# Altium project MIXR Power.PrjPcb (part 3 of 3)

## Sheet MIXR Power - Battery Management.SchDoc: MIXR Power - Battery Management
size B; Organization: Midnight Sun Solar Rayce Car Team; Address1: University of Waterloo; Address2: 200 University Ave W; Address3: Waterloo, ON, Canada; Address4: N2L 3E9; DocumentNumber: 4; SheetNumber: 4; SheetTotal: 8; Website: www.uwmidsun.com; ProjectName: ProjectName
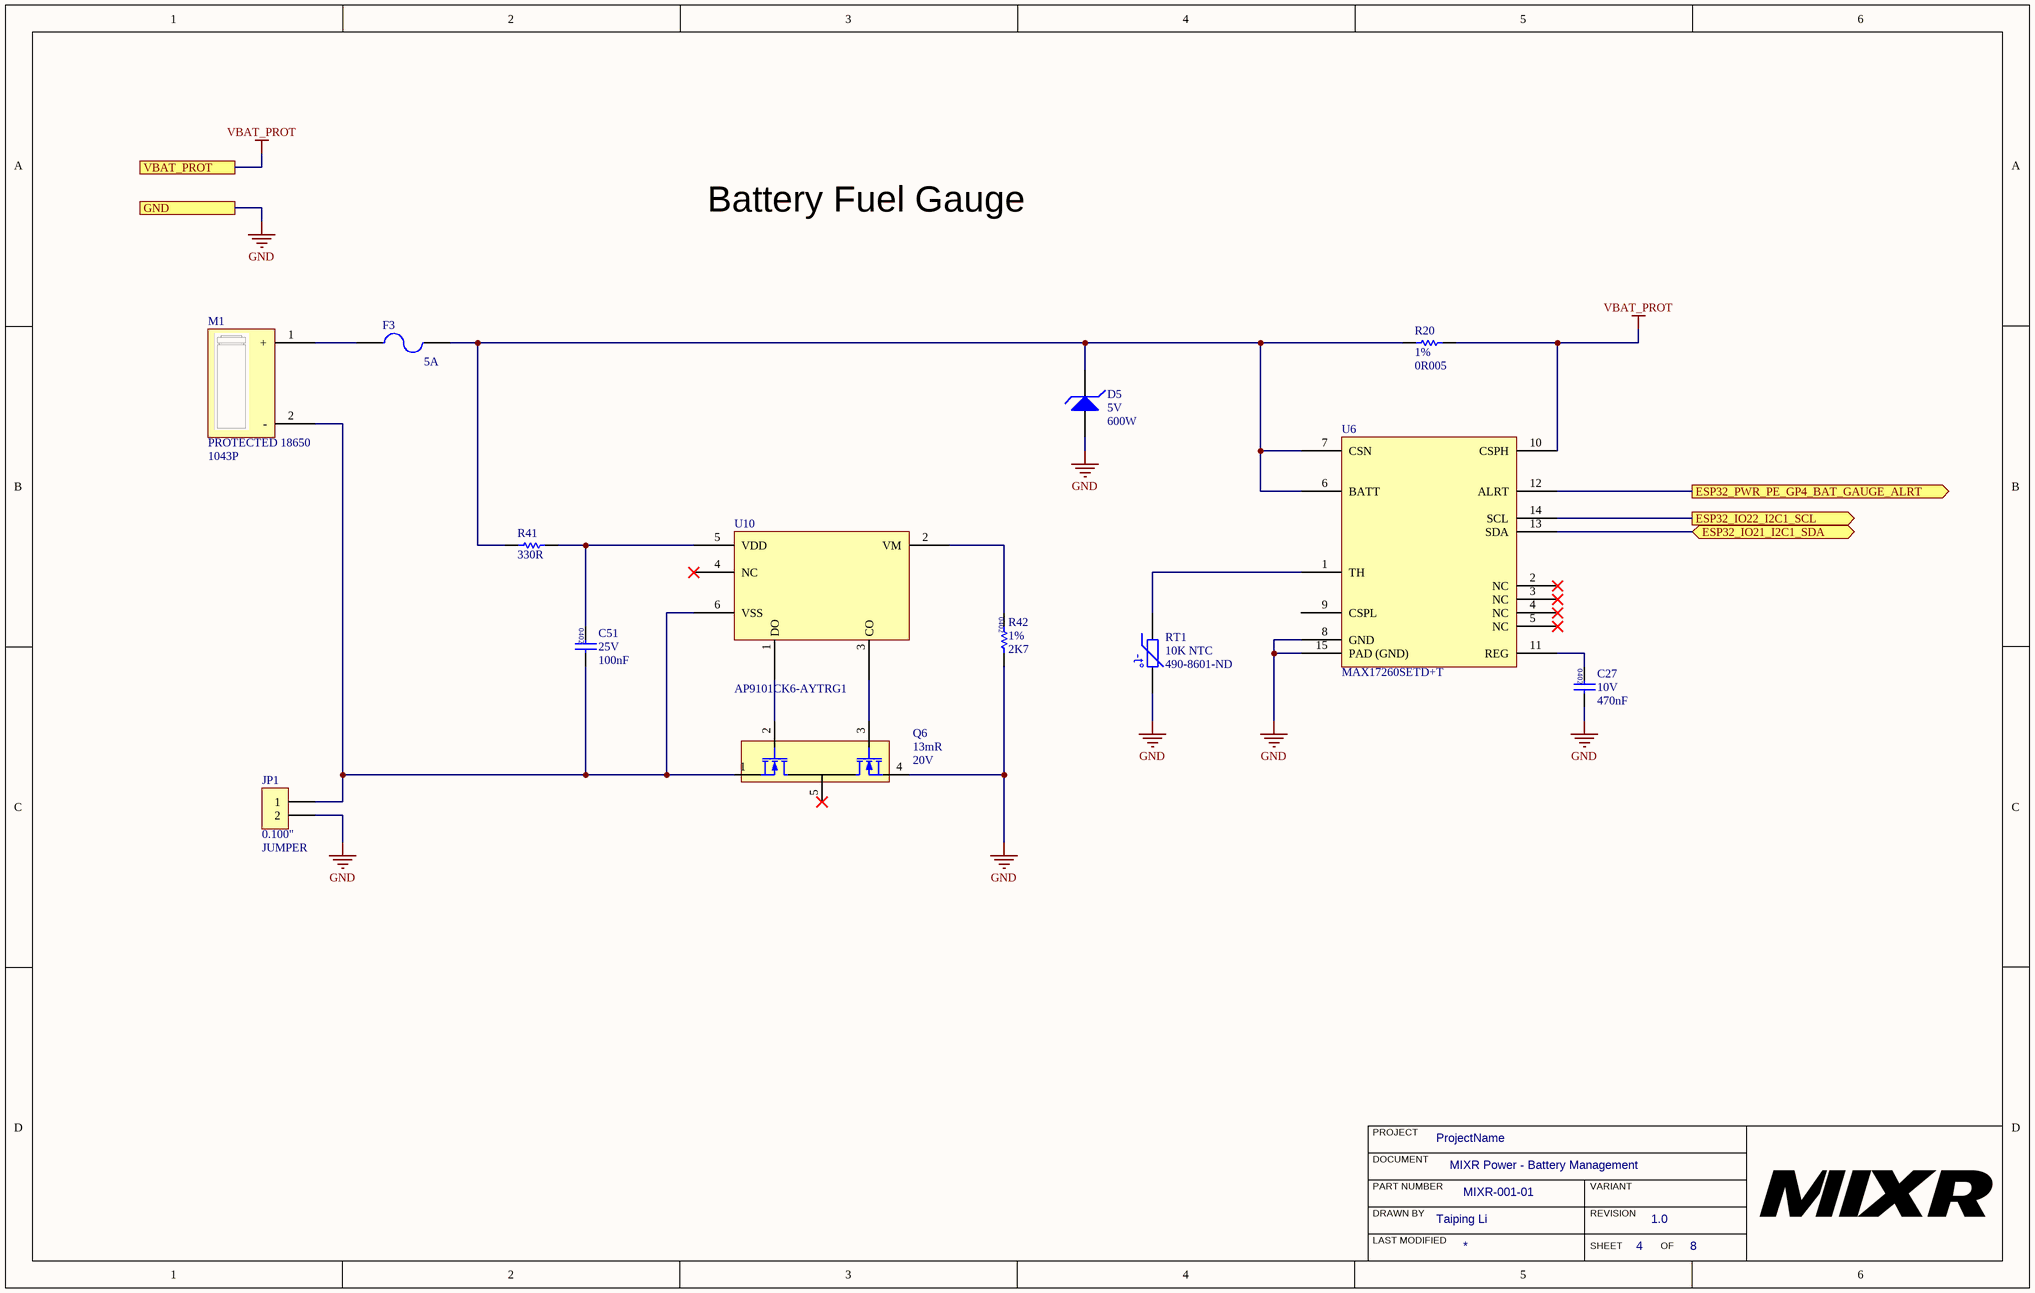
[diagram p4: MIXR Power - Battery Management.SchDoc]

### Parts
C27  Voltage Rating: 10V  Capacitance: 470nF  [CAP 0402]  (hidden comment: CAP CER 0.47UF 10V X7R 0402)
C51  Voltage: 25V  Capacitance: 100nF  [CAP 0402]  (hidden comment: CAP CER 0.1UF 16V X7R 0402)
D5  Voltage - Reverse Standoff (Typ): 5V  Power - Peak Pulse: 600W  [DO-214AA Diode]  (hidden comment: DIODE TVS 5VWM 9.1VC DO-214AA (SMB))
F3  Current Rating: 5A  [FUSE LITTLEFUSE 0466 1206]  (hidden comment: FUSE 5A 32VDC 1206)
JP1  Row Spacing - Mating: 0.100"  [CONN, 2POS JUMPER 0.1"]  (hidden comment: JUMPER)
M1  PROTECTED 18650  Manufacturer Part Number: 1043P  [BATTERY HOLDER 18650 PC PIN]
Q6  Rds On Max: 13mR  Drain to Source Voltage (Vdss): 20V  [MOSFET 2N-CH 6-UDFN]  (hidden comment: MOSFET 2N-CH 20V 9A 6-UDFN)
R20  Tolerance: 1%  Resistance: 0R005  [RES CRF0805]  (hidden comment: RES 0.005 OHM 1% 1/2W 0805)
R41  Manufacturer Part Number: 330R  [RES, 0603]  (hidden comment: RES 330 OHM 1% 1/10W 0603)
R42  Tolerance: 1%  Resistance: 2K7  [RES 0402]  (hidden comment: RES 2.7K OHM 1% 1/16W 0402)
RT1  10K NTC  Supplier Part Number 1: 490-8601-ND  [NTC THERMISTOR BEAD]
U6  Manufacturer Part Number: MAX17260SETD+T  [QFN40P300X300X80_HS-15M]  (hidden comment: IC BATT FUEL GAUGE LI-ION 14-DFN)
U10  Manufacturer Part Number: AP9101CK6-AYTRG1  [SOT23-6]  (hidden comment: IC BATT PROT LI-ION 1-CELL SOT26)

### Ports
ESP32_IO21_I2C1_SDA (bidir), ESP32_IO22_I2C1_SCL (out), ESP32_PWR_PE_GP4_BAT_GAUGE_ALRT (out), GND, VBAT_PROT

### Nets
GND: C27.2 D5.1 JP1.2 Q6.4(S2) R42.2 RT1.2 U6.8(GND) U6.15(PAD_(GND)) ; port GND
VBAT_PROT: R20.2 U6.10(CSPH) ; port VBAT_PROT
ESP32_IO21_I2C1_SDA: U6.13(SDA) ; port ESP32_IO21_I2C1_SDA
ESP32_IO22_I2C1_SCL: U6.14(SCL) ; port ESP32_IO22_I2C1_SCL
ESP32_PWR_PE_GP4_BAT_GAUGE_ALRT: U6.12(ALRT) ; port ESP32_PWR_PE_GP4_BAT_GAUGE_ALRT
NetC27_1: C27.1 U6.11(REG)
NetC51_1: C51.1 R41.2 U10.5(VDD)
NetC51_2: C51.2 JP1.1 M1.2(-) Q6.1(S1) U10.6(VSS)
NetD5_2: D5.2 F3.2 R20.1 R41.1 U6.6(BATT) U6.7(CSN)
NetF3_1: F3.1 M1.1(+)
NetQ6_2: Q6.2(G1) U10.1(DO)
NetQ6_3: Q6.3(G2) U10.3(CO)
NetR42_1: R42.1 U10.2(VM)
NetRT1_1: RT1.1 U6.1(TH)

Not connected (* = marked no-connect by the designer): Q6 5(D)*; U6 2(NC)* 3(NC)* 4(NC)* 5(NC)* 9(CSPL); U10 4(NC)*

### Notes on the sheet
- Battery Fuel Gauge
- PROJECT
- DOCUMENT
- DRAWN BY
- LAST MODIFIED
- PART NUMBER
- REVISION
- SHEET
- VARIANT
- OF
- (in symbol NTC THERMISTOR 10K 1% BEAD) -t°

### Library data of the parts
C27 = CAP CER 0.47UF 10V X7R 0402: CAP ,MLCC ,0402,6.3V,X7R,0.47uF, 10% ,T&R;; Manufacturer: Taiyo Yuden; Manufacturer Part Number: LMK105B7474KV-F; Supplier 1: Digi-Key; RoHS: Yes; Category: Ceramic Capacitors; Stock 1: 68675; Pricing 1: 1=0.25000, 10=0.17500, 100=0.09890, 500=0.06982, 1000=0.06110, 2500=0.05819, 5000=0.05383 (USD); Mount: Surface Mount; Case/Package: 0402; Min Operating Temperature: -55°C; Max Operating Temperature: 125°C; Packaging: Tape and Reel; Tolerance: 10%; Voltage Rating (DC): 10V; Length: 0.039inch; Width: 0.02inch; Thickness: 0.022inch; Halogen Free: Halogen Free; ComponentLink1URL: http://www.yuden.co.jp/productdata/catalog/en/mlcc_all_e.pdf?src-supplier=Digi-Key; ComponentLink1Description: http://www.yuden.co.jp/productdata/catalog/en/mlcc_all_e.pdf?src-supplier=Digi-Key; ComponentLink2URL: http://ds.yuden.co.jp/TYCOMPAS/ut/detail.do?productNo=LMK105B7474KV-F&fileName=LMK105B7474KV-F_SS&mode=specSheetDownload&src-supplier=Digi-Key; ComponentLink2Description: http://ds.yuden.co.jp/TYCOMPAS/ut/detail.do?productNo=LMK105B7474KV-F&fileName=LMK105B7474KV-F_SS&mode=specSheetDownload&src-supplier=Digi-Key; ComponentLink3URL: https://www.yuden.co.jp/productdata/catalog/mlcc01_e.pdf?src-supplier=Digi-Key; ComponentLink3Description: https://www.yuden.co.jp/productdata/catalog/mlcc01_e.pdf?src-supplier=Digi-Key; Supplier Part Number 1: 587-5912-1-ND
C51 = CAP CER 0.1UF 16V X7R 0402: Cap Ceramic 0.1uF 25V X7R 10% SMD 0402 125C Paper T/R; Manufacturer: Murata; Manufacturer Part Number: GRM155R71E104KE14D; Supplier 1: Digi-Key; RoHS: Yes; Category: Ceramic Capacitors; Stock 1: 785540; Pricing 1: 1=0.10000, 10=0.03400, 100=0.01520, 500=0.01088, 1000=0.00855, 2500=0.00778, 5000=0.00715 (USD); Mount: Surface Mount; Case/Package: 0402; Weight: 0.000212oz; Case Code (Metric): 1005; Case Code (Imperial): 0402; Dielectric Material: Ceramic; Min Operating Temperature: -55°C; Max Operating Temperature: 125°C; Packaging: Tape and Reel; Tolerance: 10%; Termination: SMD/SMT; Composition: Ceramic; Package Quantity: 10000; Length: 1mm; Height: 0.5mm; Width: 0.02inch; Thickness: 0.022inch; Depth: 0.5mm; REACH SVHC: Unknown; Lead Free: Lead Free; ComponentLink1URL: http://www.farnell.com/datasheets/2048008.pdf?src-supplier=Farnell; ComponentLink1Description: http://www.farnell.com/datasheets/2048008.pdf?src-supplier=Farnell; ComponentLink2URL: http://uk.rs-online.com/webdocs/144c/0900766b8144c113.pdf?src-supplier=RSComponents; ComponentLink2Description: http://uk.rs-online.com/webdocs/144c/0900766b8144c113.pdf?src-supplier=RSComponents; ComponentLink3URL: http://www.farnell.com/datasheets/1872206.pdf?src-supplier=Farnell; ComponentLink3Description: http://www.farnell.com/datasheets/1872206.pdf?src-supplier=Farnell; ComponentLink4URL: http://components.arrow.com/part/dataview/0323_06361249?src-supplier=Arrow+Europe; ComponentLink4Description: http://components.arrow.com/part/dataview/0323_06361249?src-supplier=Arrow+Europe; ComponentLink5URL: http://www.mouser.com/ds/2/281/c02e-2905.pdf?src-supplier=Mouser; ComponentLink5Description: http://www.mouser.com/ds/2/281/c02e-2905.pdf?src-supplier=Mouser; ComponentLink6URL: http://www.farnell.com/datasheets/2048008.pdf?src-supplier=Newark; ComponentLink6Description: http://www.farnell.com/datasheets/2048008.pdf?src-supplier=Newark; ComponentLink7URL: http://psearch.en.murata.com/capacitor/product/GRM155R71E104KE14%23.pdf?src-supplier=Avnet; ComponentLink7Description: http://psearch.en.murata.com/capacitor/product/GRM155R71E104KE14%23.pdf?src-supplier=Avnet; ComponentLink8URL: https://search.murata.co.jp/Ceramy/image/img/A01X/G101/ENG/GRM155R71E104KE14-01.pdf?src-supplier=Digi-Key; ComponentLink8Description: https://search.murata.co.jp/Ceramy/image/img/A01X/G101/ENG/GRM155R71E104KE14-01.pdf?src-supplier=Digi-Key; ComponentLink9URL: http://www.farnell.com/datasheets/2048008.pdf?src-supplier=Element14; ComponentLink9Description: http://www.farnell.com/datasheets/2048008.pdf?src-supplier=Element14; Supplier Part Number 1: 490-10698-1-ND; Dielectric: X7R; Voltage Rating (DC): 25V; Voltage Rating: 25V
D5 = DIODE TVS 5VWM 9.1VC DO-214AA (SMB): TVS DIODE 5V 9.1V DO214AA; Manufacturer: Vishay Semiconductor Diodes Division; Manufacturer Part Number: SMBJ5.0D-M3/H; Type: Zener; Voltage - Breakdown (Min): 6.5V; Current - Peak Pulse (10/1000µs): 65.9A; Power Line Protection: No; Supplier 1: Digi-Key; RoHS: RoHS Compliant; Category: Circuit Protection; Stock 1: 6900; Pricing 1: 1=0.51, 10=0.416, 25=0.3808, 100=0.2833, 250=0.25668 (CAD); Packaging: Cut Tape (CT); Part Status: Active; Voltage - Clamping (Max) @ Ipp: 9.1V; Applications: General Purpose; Capacitance @ Frequency: -; Operating Temperature: -55°C ~ 150°C (TJ); Mounting Type: Surface Mount; Package / Case: DO-214AA, SMB; Supplier Device Package: DO-214AA (SMBJ); ComponentLink1URL: http://www.vishay.com/docs/87606/87606.pdf; ComponentLink1Description: http://www.vishay.com/docs/87606/87606.pdf; Supplier Part Number 1: SMBJ5.0D-M3/HGICT-ND
F3 = FUSE 5A 32VDC 1206: FUSE 5.0A 125VAC FAST 1206; Manufacturer: Bel TRP; Manufacturer Part Number: C1F5; Voltage Rating (AC): 125V; Voltage Rating (DC): 63V; DC Cold Resistance: 19mR; Fuse Type: Board Mount (Cartridge Style Excluded); Approvals: CE,cURus; Supplier 1: Digi-Key; RoHS: Yes; Category: Fuses; Stock 1: 12696; Pricing 1: 1=0.29000, 5=0.27800, 10=0.26500, 50=0.23660, 100=0.22030, 250=0.19584, 500=0.16320, 1000=0.15504 (USD); Mount: Surface Mount; Number of Pins: 2; Case Code (Metric): 3216; Case Code (Imperial): 1206; Contact Plating: Tin; Min Operating Temperature: -55°C; Max Operating Temperature: 125°C; Packaging: Tape and Reel; Voltage Rating: 125V; Length: 0.126inch; Width: 0.062inch; ComponentLink1URL: http://www.mouser.com/ds/2/643/C1F-594910.pdf?src-supplier=Mouser; ComponentLink1Description: http://www.mouser.com/ds/2/643/C1F-594910.pdf?src-supplier=Mouser; ComponentLink2URL: http://belfuse.com/pdfs/C1F.pdf?src-supplier=Avnet; ComponentLink2Description: http://belfuse.com/pdfs/C1F.pdf?src-supplier=Avnet; ComponentLink3URL: https://belfuse.com/resources/datasheets/circuitprotection/ds-cp-c1f-series.pdf?src-supplier=Digi-Key; ComponentLink3Description: https://belfuse.com/resources/datasheets/circuitprotection/ds-cp-c1f-series.pdf?src-supplier=Digi-Key; Supplier Part Number 1: 507-1886-1-ND; Case/Package: 1206
JP1 = CONN 2POS JUMPER 0.1": 2 Positions Header Connector Through Hole Gold; Manufacturer: Omron Electronics Inc-EMC Div; Manufacturer Part Number: XG8T-0231; Style: Board to Board or Cable; Shrouding: Unshrouded; Number of Positions: 2; Number of Positions Loaded: All; Contact Length - Mating: 0.169" (4.30mm); Contact Length - Post: 0.118" (3.00mm); Overall Contact Length: 0.386" (9.80mm); Material Flammability Rating: UL94 V-0; Current Rating: 2A; Voltage Rating: 300V; Supplier 1: Digi-Key; RoHS: RoHS Compliant; Category: Connectors, Interconnects; Stock 1: 9094; Pricing 1: 1=0.28, 10=0.265, 100=0.183, 500=0.15484, 1000=0.12668, 5000=0.11261, 10000=0.10205 (CAD); Packaging: Bulk; Part Status: Active; Connector Type: Header; Contact Type: Male Pin; Pitch - Mating: -; Number of Rows: 2; Mounting Type: Through Hole; Termination: Solder; Fastening Type: -; Insulation Height: 0.098" (2.50mm); Contact Shape: Square; Contact Finish - Mating: Gold; Contact Finish Thickness - Mating: 5.9µin (0.15µm); Contact Finish - Post: Tin; Contact Material: Brass, Nickel; Insulation Material: Polybutylene Terephthalate (PBT), Glass Filled; Features: -; Operating Temperature: -55°C ~ 105°C; Ingress Protection: -; Insulation Color: Black; Mated Stacking Heights: -; Contact Finish Thickness - Post: -; Applications: -; ComponentLink1URL: http://www.omron.com/ecb/products/pdf/en-xj8.pdf; ComponentLink1Description: http://www.omron.com/ecb/products/pdf/en-xj8.pdf; Supplier Part Number 1: XG8T-0231-ND; Type: JUMPER
M1 = BATTERY HOLDER 18650: BATTERY HOLDER 18650 PC PIN; Manufacturer: Keystone Electronics; Number of Cells: 1; Supplier 1: Digi-Key; RoHS: Yes; Category: Uncategorized; Stock 1: 6353; Pricing 1: 1=2.58000, 25=2.16760, 100=1.91000, 250=1.82000, 500=1.67000, 1000=1.52000, 2500=1.30900, 5000=1.19000 (USD); Mount: Through Hole,PCB; Min Operating Temperature: -50°C; Max Operating Temperature: 145°C; Package Quantity: 50; Termination: PC Pin; Packaging: Tray; ComponentLink1URL: https://datasheet.ciiva.com/41860/1043p-41860216.pdf?src-supplier=Digi-Key; ComponentLink1Description: https://datasheet.ciiva.com/41860/1043p-41860216.pdf?src-supplier=Digi-Key; Supplier Part Number 1: 36-1043P-ND
Q6 = MOSFET 2N-CH 20V 9A 6-UDFN: Manufacturer: Diodes; Manufacturer Part Number: DMN2014LHAB-7; Input Capacitance: 1.55nF; Rise Time: 15.5ns; Continuous Drain Current (ID): 9.3A; Max Power Dissipation: 800mW; Drain to Source Resistance: 28mR; Turn-Off Delay Time: 40.9ns; Turn-On Delay Time: 6.9ns; Fall Time: 12ns; Gate to Source Voltage (Vgs): 12V; FET Type: 2 N-Channel; Supplier 1: Digi-Key; RoHS: Yes; Category: MOSFETs; Stock 1: 3087; Pricing 1: 1=0.51000, 10=0.43800, 100=0.30340, 500=0.23688, 1000=0.19254 (USD); Mount: Surface Mount; Case/Package: DFN; Number of Pins: 7; Min Operating Temperature: -55°C; Max Operating Temperature: 150°C; Package Quantity: 3000; Packaging: Tape and Reel; Length: 3.05mm; Height: 0.6mm; Width: 2.05mm; ComponentLink1URL: https://datasheet.ciiva.com/29590/dmn2014lhab-29590005.pdf?src-supplier=Digi-Key; ComponentLink1Description: https://datasheet.ciiva.com/29590/dmn2014lhab-29590005.pdf?src-supplier=Digi-Key; ComponentLink2URL: https://datasheet.ciiva.com/29590/dmn2014lhab-29590007.pdf?src-supplier=Digi-Key; ComponentLink2Description: https://datasheet.ciiva.com/29590/dmn2014lhab-29590007.pdf?src-supplier=Digi-Key; ComponentLink3URL: https://datasheet.ciiva.com/29590/dmn2014lhab-29590006.pdf?src-supplier=Digi-Key; ComponentLink3Description: https://datasheet.ciiva.com/29590/dmn2014lhab-29590006.pdf?src-supplier=Digi-Key; Supplier Part Number 1: DMN2014LHAB-7DICT-ND
R20 = RES 0.005 OHM 1% 1/2W 0805: 5 mOhms ±1% 0.5W, 1/2W Chip Resistor 0805 (2012 Metric) Automotive AEC-Q200, Current Sense, Moisture Resistant Metal Element; Manufacturer: Bourns; Manufacturer Part Number: CRF0805-FZ-R005ELF; Power Rating: 500mW; Temperature Coefficient: 75ppm/°C; Supplier 1: Digi-Key; RoHS: Yes; Category: Chip SMD Resistors; Stock 1: 12417; Pricing 1: 1=0.54000, 10=0.41700, 100=0.17550, 1000=0.09680, 2500=0.09075 (USD); Case/Package: 0805; Weight: 0.000194oz; Case Code (Imperial): 0805; Case Code (Metric): 2012; Min Operating Temperature: -55°C; Max Operating Temperature: 170°C; Packaging: Tape and Reel; Package Quantity: 5000; Composition: Metal Film; Number of Terminations: 2; Termination: SMD/SMT; Max Power Dissipation: 500mW; Features: Moisture Resistant,Automotive AEC-Q200; Length: 0.079inch; Height: 0.6mm; Width: 0.049inch; Height - Seated (Max): 0.031inch; ComponentLink1URL: http://www.farnell.com/datasheets/2194442.pdf?src-supplier=Farnell; ComponentLink1Description: http://www.farnell.com/datasheets/2194442.pdf?src-supplier=Farnell; ComponentLink2URL: http://www.mouser.com/ds/2/54/rf-937137.pdf?src-supplier=Mouser; ComponentLink2Description: http://www.mouser.com/ds/2/54/rf-937137.pdf?src-supplier=Mouser; ComponentLink3URL: http://www.farnell.com/datasheets/2194442.pdf?src-supplier=Newark; ComponentLink3Description: http://www.farnell.com/datasheets/2194442.pdf?src-supplier=Newark; ComponentLink4URL: https://www.bourns.com/docs/Product-Datasheets/CRF.pdf?src-supplier=Digi-Key; ComponentLink4Description: https://www.bourns.com/docs/Product-Datasheets/CRF.pdf?src-supplier=Digi-Key; Supplier Part Number 1: CRF0805-FZ-R005ELFCT-ND
R41 = RES 330 OHM 1% 1/10W 0603: 330 Ohms ±1% 0.1W, 1/10W Chip Resistor 0603 (1608 Metric) Automotive AEC-Q200, Moisture Resistant Thick Film; Manufacturer: TE Connectivity; Supplier 1: Digi-Key; Supplier Part Number 1: A129682CT-ND; RoHS: No; Stock 1: 87700; Pricing 1: 1 = 0.10000, 10 = 0.03300, 100 = 0.01320, 1000 = 0.00595, 2500 = 0.00516 (USD); ComponentLink1URL: http://www.te.com/commerce/DocumentDelivery/DDEController?Action=srchrtrv&DocNm=1773204-3&DocType=DS&DocLang=English&src-supplier=Digi-Key; ComponentLink1Description: http://www.te.com/commerce/DocumentDelivery/DDEController?Action=srchrtrv&DocNm=1773204-3&DocType=DS&DocLang=English&src-supplier=Digi-Key; ComponentLink2URL: https://www.te.com/commerce/DocumentDelivery/DDEController?Action=srchrtrv&DocNm=1773204-3&DocType=DS&DocLang=English&src-supplier=Digi-Key; ComponentLink2Description: https://www.te.com/commerce/DocumentDelivery/DDEController?Action=srchrtrv&DocNm=1773204-3&DocType=DS&DocLang=English&src-supplier=Digi-Key
R42 = RES 2.7K OHM 1% 1/16W 0402: 2.7 kOhms ±1% 0.1W, 1/10W Chip Resistor 0402 (1005 Metric) Automotive AEC-Q200 Thick Film; Manufacturer: Panasonic; Manufacturer Part Number: ERJ-2RKF2701X; Temperature Coefficient: 100ppm/°C; Power Rating: 100mW; Voltage Rating: 50V; Supplier 1: Digi-Key; RoHS: Yes; Category: Chip SMD Resistors; Stock 1: 344590; Pricing 1: 1=0.10000, 10=0.04100, 100=0.01670, 1000=0.00751, 2500=0.00652, 5000=0.00538 (USD); Mount: Surface Mount; Case/Package: 0402; Number of Pins: 2; Contact Plating: Tin; Case Code (Metric): 1005; Case Code (Imperial): 0402; Min Operating Temperature: -55°C; Max Operating Temperature: 155°C; Composition: Thick Film; Packaging: Tape and Reel; Package Quantity: 1; Number of Terminations: 2; Termination: SMD/SMT; Military Standard: Not; Max Power Dissipation: 100mW; Voltage Rating (DC): 50V; Features: Automotive AEC-Q200; Length: 1mm; Height: 0.35mm; Width: 0.02inch; Depth: 0.5mm; Radiation Hardening: No; REACH SVHC: No SVHC; Lead Free: Lead Free; ComponentLink1URL: https://datasheet.ciiva.com/3883/3984280s8821682n1386-3883650.pdf?src-supplier=Arrow; ComponentLink1Description: https://datasheet.ciiva.com/3883/3984280s8821682n1386-3883650.pdf?src-supplier=Arrow; ComponentLink2URL: https://datasheet.ciiva.com/11821/0900766b80f80784-11821269.pdf?src-supplier=RSComponents; ComponentLink2Description: https://datasheet.ciiva.com/11821/0900766b80f80784-11821269.pdf?src-supplier=RSComponents; ComponentLink3URL: https://datasheet.ciiva.com/22668/1678782-22668310.pdf?src-supplier=Element14; ComponentLink3Description: https://datasheet.ciiva.com/22668/1678782-22668310.pdf?src-supplier=Element14; ComponentLink4URL: https://datasheet.ciiva.com/24071/aoa0000ce2-24071174.pdf?src-supplier=Mouser; ComponentLink4Description: https://datasheet.ciiva.com/24071/aoa0000ce2-24071174.pdf?src-supplier=Mouser; ComponentLink5URL: https://datasheet.ciiva.com/7802/aoa0000ce2-7802407.pdf?src-supplier=Element14; ComponentLink5Description: https://datasheet.ciiva.com/7802/aoa0000ce2-7802407.pdf?src-supplier=Element14; ComponentLink6URL: https://datasheet.ciiva.com/9196/aoa0000ce2-9196887.pdf?src-supplier=Avnet; ComponentLink6Description: https://datasheet.ciiva.com/9196/aoa0000ce2-9196887.pdf?src-supplier=Avnet; ComponentLink7URL: https://datasheet.ciiva.com/43467/1678782-43467351.pdf?src-supplier=Farnell; ComponentLink7Description: https://datasheet.ciiva.com/43467/1678782-43467351.pdf?src-supplier=Farnell; ComponentLink8URL: https://datasheet.ciiva.com/46372/1678782-46372856.pdf?src-supplier=Element14; ComponentLink8Description: https://datasheet.ciiva.com/46372/1678782-46372856.pdf?src-supplier=Element14; ComponentLink9URL: https://datasheet.ciiva.com/16775/70260748-16775161.pdf?src-supplier=Allied+Electronics; ComponentLink9Description: https://datasheet.ciiva.com/16775/70260748-16775161.pdf?src-supplier=Allied+Electronics; ComponentLink10URL: https://datasheet.ciiva.com/16778/70260748-16778345.pdf?src-supplier=Allied+Electronics; ComponentLink10Description: https://datasheet.ciiva.com/16778/70260748-16778345.pdf?src-supplier=Allied+Electronics; ComponentLink11URL: https://datasheet.ciiva.com/46372/1678782-46372857.pdf?src-supplier=Element14; ComponentLink11Description: https://datasheet.ciiva.com/46372/1678782-46372857.pdf?src-supplier=Element14; ComponentLink12URL: https://datasheet.ciiva.com/6138/aoa0000ce2-6138171.pdf?src-supplier=Farnell; ComponentLink12Description: https://datasheet.ciiva.com/6138/aoa0000ce2-6138171.pdf?src-supplier=Farnell; ComponentLink13URL: https://datasheet.ciiva.com/22687/1678782-22687069.pdf?src-supplier=Element14; ComponentLink13Description: https://datasheet.ciiva.com/22687/1678782-22687069.pdf?src-supplier=Element14; ComponentLink14URL: https://datasheet.ciiva.com/17213/aoa0000ce2-17213982.pdf?src-supplier=Avnet+Europe; ComponentLink14Description: https://datasheet.ciiva.com/17213/aoa0000ce2-17213982.pdf?src-supplier=Avnet+Europe; Supplier Part Number 1: P2.70KLCT-ND
RT1 = NTC THERMISTOR 10K 1% BEAD: NTC Thermistor 10k Bead; Manufacturer: Murata Electronics North America; Manufacturer Part Number: NXRT15XH103FA1B030; Resistance Tolerance: ±1%; B25/50: 3380K; B25/85: 3434K; B25/100: 3455K; Supplier 1: Digi-Key; RoHS: RoHS Compliant; Category: Sensors, Transducers; Stock 1: 25017; Pricing 1: 1=0.96, 5=0.91, 10=0.792, 25=0.696, 50=0.5784, 100=0.4925, 500=0.42834, 1000=0.3748, 5000=0.33197 (CAD); Packaging: Bulk; Part Status: Active; Resistance in Ohms @ 25°C: 10k; B Value Tolerance: ±1%; B0/50: -; B25/75: -; Operating Temperature: -40°C ~ 125°C; Length - Lead Wire: -; Mounting Type: Through Hole; Package / Case: Bead; ComponentLink1URL: https://www.murata.com/~/media/webrenewal/support/library/catalog/products/thermistor/ntc/r44e.ashx; ComponentLink1Description: https://www.murata.com/~/media/webrenewal/support/library/catalog/products/thermistor/ntc/r44e.ashx
U6 = IC BATT FUEL GAUGE LI-ION 14-DFN: Battery Management 5.1 A 1-Cell Fuel Gauge with ModelGauge m5 EZ and Optional High-SideCurrent Sensing; Manufacturer: Maxim; Supplier 1: Mouser; RoHS: No; Stock 1: 3038; Pricing 1: 1=2.39000, 10=2.26000, 25=1.80000, 50=1.71000, 100=1.58000, 250=1.50000, 500=1.45000, 1000=1.31000, 2500=1.07000 (USD); Supplier Part Number 1: 700-MAX17260SETD+T
U10 = IC BATT PROT LI-ION 1-CELL SOT26: Battery Battery Protection IC Lithium Ion/Polymer SOT-26; Manufacturer: Diodes; Supplier 1: Digi-Key; RoHS: No; Stock 1: 3484; Pricing 1: 1=0.45000, 10=0.36700, 100=0.24960, 500=0.18720, 1000=0.14040 (USD); Supplier Part Number 1: AP9101CK6-AYTRG1DICT-ND

## Sheet MIXR Power - Port Expander.SchDoc: MIXR Power - I2C Port Expander
size B; Organization: Midnight Sun Solar Rayce Car Team; Address1: University of Waterloo; Address2: 200 University Ave W; Address3: Waterloo, ON, Canada; Address4: N2L 3E9; DocumentNumber: 8; SheetNumber: 8; SheetTotal: 8; Website: www.uwmidsun.com; ProjectName: ProjectName
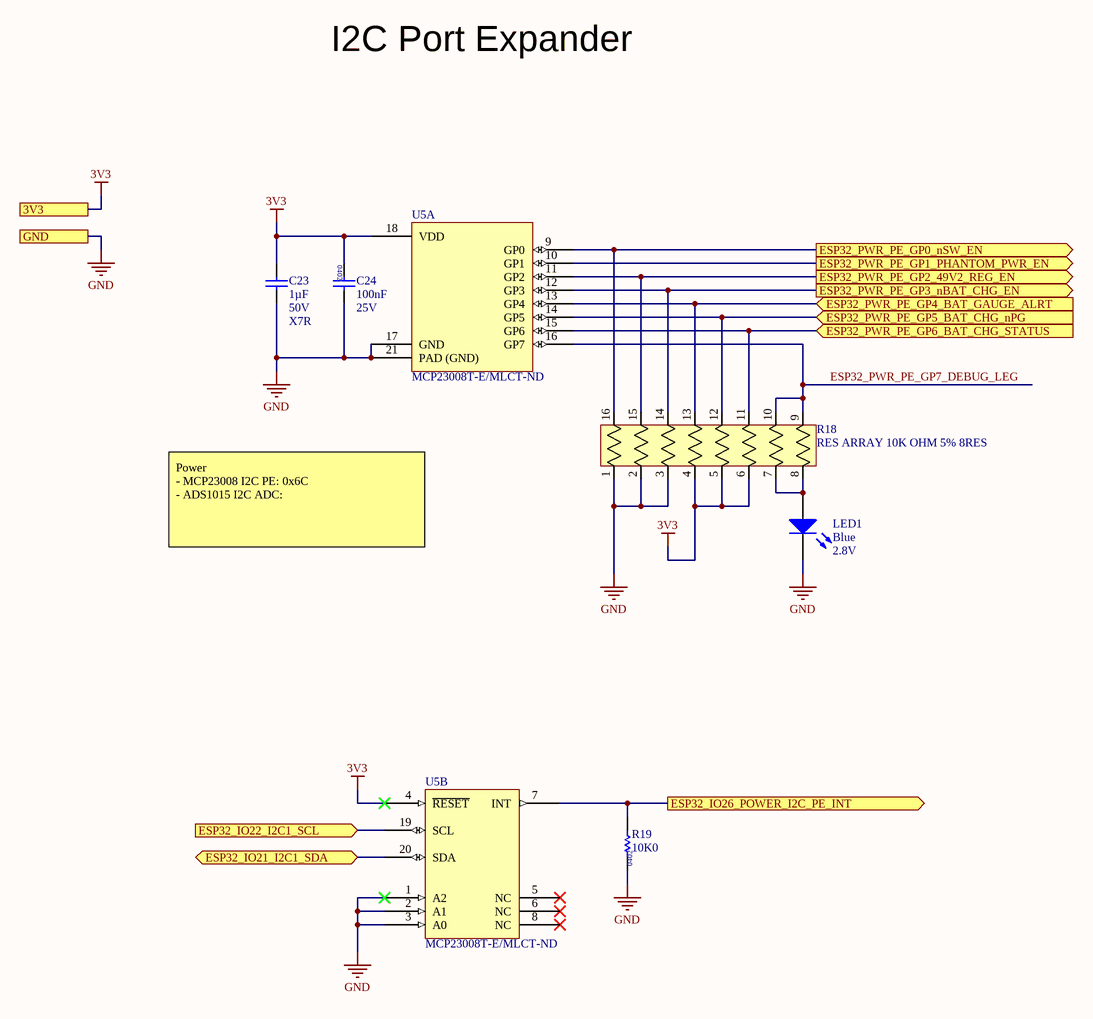
[diagram p5: MIXR Power - Port Expander.SchDoc]

### Parts
C23  Capacitance: 1µF  Voltage: 50V  Temperature Coefficient: X7R  [CAP, 0603]  (hidden comment: CAP CER 1UF 50V 10% X7R 0603)
C24  Capacitance: 100nF  Voltage: 25V  [CAP 0402]  (hidden comment: CAP CER 0.1UF 16V X7R 0402)
LED1  Color: Blue  Voltage - Forward (Vf) (Typ): 2.8V  [LED_0603]  (hidden comment: LED BLUE CLEAR 2.8V 0603)
R18  RES ARRAY 10K OHM 5% 8RES  [RES ARRAY, 8 POS 1506]
R19  Resistance: 10K0  [RES 0402]  (hidden comment: RES 10K OHM 1% 1/16W 0402)
U5  Supplier Part Number 1: MCP23008T-E/MLCT-ND  [QFN50P400X400X100_HS-21M]  (hidden comment: MCP23008)  (parts A,B of 2)

### Ports
3V3, ESP32_IO21_I2C1_SDA (bidir), ESP32_IO22_I2C1_SCL (in), ESP32_IO26_POWER_I2C_PE_INT (out), ESP32_PWR_PE_GP0_nSW_EN (out), ESP32_PWR_PE_GP1_PHANTOM_PWR_EN (out), ESP32_PWR_PE_GP2_49V2_REG_EN (out), ESP32_PWR_PE_GP3_nBAT_CHG_EN (out), ESP32_PWR_PE_GP4_BAT_GAUGE_ALRT (in), ESP32_PWR_PE_GP5_BAT_CHG_nPG (in), ESP32_PWR_PE_GP6_BAT_CHG_STATUS (in), GND

### Nets
3V3: C23.1 C24.1 R18.4 R18.5 R18.6 U5.4(~{RESET}) U5.18(VDD) ; port 3V3
GND: C23.2 C24.2 LED1.2(K) R18.1 R18.2 R18.3 R19.1 U5.1(A2) U5.2(A1) U5.3(A0) U5.17(GND) U5.21(PAD_(GND)) ; port GND
ESP32_IO21_I2C1_SDA: U5.20(SDA) ; port ESP32_IO21_I2C1_SDA
ESP32_IO22_I2C1_SCL: U5.19(SCL) ; port ESP32_IO22_I2C1_SCL
ESP32_IO26_POWER_I2C_PE_INT: R19.2 U5.7(INT) ; port ESP32_IO26_POWER_I2C_PE_INT
ESP32_PWR_PE_GP0_nSW_EN: R18.16 U5.9(GP0) ; port ESP32_PWR_PE_GP0_nSW_EN
ESP32_PWR_PE_GP1_PHANTOM_PWR_EN: U5.10(GP1) ; port ESP32_PWR_PE_GP1_PHANTOM_PWR_EN
ESP32_PWR_PE_GP2_49V2_REG_EN: R18.15 U5.11(GP2) ; port ESP32_PWR_PE_GP2_49V2_REG_EN
ESP32_PWR_PE_GP3_nBAT_CHG_EN: R18.14 U5.12(GP3) ; port ESP32_PWR_PE_GP3_nBAT_CHG_EN
ESP32_PWR_PE_GP4_BAT_GAUGE_ALRT: R18.13 U5.13(GP4) ; port ESP32_PWR_PE_GP4_BAT_GAUGE_ALRT
ESP32_PWR_PE_GP5_BAT_CHG_nPG: R18.12 U5.14(GP5) ; port ESP32_PWR_PE_GP5_BAT_CHG_nPG
ESP32_PWR_PE_GP6_BAT_CHG_STATUS: R18.11 U5.15(GP6) ; port ESP32_PWR_PE_GP6_BAT_CHG_STATUS
ESP32_PWR_PE_GP7_DEBUG_LEG: R18.9 R18.10 U5.16(GP7)  [project net ESP32_PWR_PE_GP7_DEBUG_LEG_8]
NetLED1_1: LED1.1(A) R18.7 R18.8

Not connected (* = marked no-connect by the designer): U5 5(NC)* 6(NC)* 8(NC)*

### Notes on the sheet
- I2C Port Expander
- Power
  - MCP23008 I2C PE: 0x6C
  - ADS1015 I2C ADC:
- PROJECT
- DOCUMENT
- DRAWN BY
- LAST MODIFIED
- PART NUMBER
- REVISION
- SHEET
- VARIANT
- OF

### Library data of the parts
C23 = CAP CER 1UF 50V 10% X7R 0603: 1µF ±10% 50V Ceramic Capacitor X7R 0603 (1608 Metric); Manufacturer 1: Taiyo Yuden; Manufacturer Part Number 1: UMK107AB7105KA-T; Supplier 1: Digi-Key; Supplier Part Number 1: 587-3247-1-ND; Packaging: Cut Tape (CT); Part Status: Active; Operating Temperature: -55°C ~ 125°C; Ratings: -; Mounting Type: Surface Mount, MLCC; Package / Case: 0603 (1608 Metric); Size / Dimension: 0.063" L x 0.031" W (1.60mm x 0.80mm); Height - Seated (Max): -; Thickness (Max): 0.037" (0.95mm); Lead Spacing: -; Lead Style: -; ComponentLink1URL: http://www.yuden.co.jp/productdata/catalog/en/mlcc_all_e.pdf; ComponentLink1Description: http://www.yuden.co.jp/productdata/catalog/en/mlcc_all_e.pdf; Tolerance: ±10%
C24 = CAP CER 0.1UF 16V X7R 0402: as C51 on sheet MIXR Power - Battery Management; Supplier 1: Digi-Key; Supplier Part Number 1: 490-10698-1-ND; Packaging: Tape and Reel; ComponentLink1URL: http://www.farnell.com/datasheets/2048008.pdf?src-supplier=Farnell; ComponentLink1Description: http://www.farnell.com/datasheets/2048008.pdf?src-supplier=Farnell; Tolerance: 10%; RoHS: Yes; Category: Ceramic Capacitors; Stock 1: 785540; Pricing 1: 1=0.10000, 10=0.03400, 100=0.01520, 500=0.01088, 1000=0.00855, 2500=0.00778, 5000=0.00715 (USD); Mount: Surface Mount; Case/Package: 0402; Weight: 0.000212oz; Case Code (Metric): 1005; Case Code (Imperial): 0402; Dielectric Material: Ceramic; Min Operating Temperature: -55°C; Max Operating Temperature: 125°C; Termination: SMD/SMT; Composition: Ceramic; Voltage Rating (DC): 25V; Package Quantity: 10000; Length: 1mm; Height: 0.5mm; Width: 0.02inch; Thickness: 0.022inch; Depth: 0.5mm; REACH SVHC: Unknown; Lead Free: Lead Free; ComponentLink2URL: http://uk.rs-online.com/webdocs/144c/0900766b8144c113.pdf?src-supplier=RSComponents; ComponentLink2Description: http://uk.rs-online.com/webdocs/144c/0900766b8144c113.pdf?src-supplier=RSComponents; ComponentLink3URL: http://www.farnell.com/datasheets/1872206.pdf?src-supplier=Farnell; ComponentLink3Description: http://www.farnell.com/datasheets/1872206.pdf?src-supplier=Farnell; ComponentLink4URL: http://components.arrow.com/part/dataview/0323_06361249?src-supplier=Arrow+Europe; ComponentLink4Description: http://components.arrow.com/part/dataview/0323_06361249?src-supplier=Arrow+Europe; ComponentLink5URL: http://www.mouser.com/ds/2/281/c02e-2905.pdf?src-supplier=Mouser; ComponentLink5Description: http://www.mouser.com/ds/2/281/c02e-2905.pdf?src-supplier=Mouser; ComponentLink6URL: http://www.farnell.com/datasheets/2048008.pdf?src-supplier=Newark; ComponentLink6Description: http://www.farnell.com/datasheets/2048008.pdf?src-supplier=Newark; ComponentLink7URL: http://psearch.en.murata.com/capacitor/product/GRM155R71E104KE14%23.pdf?src-supplier=Avnet; ComponentLink7Description: http://psearch.en.murata.com/capacitor/product/GRM155R71E104KE14%23.pdf?src-supplier=Avnet; ComponentLink8URL: https://search.murata.co.jp/Ceramy/image/img/A01X/G101/ENG/GRM155R71E104KE14-01.pdf?src-supplier=Digi-Key; ComponentLink8Description: https://search.murata.co.jp/Ceramy/image/img/A01X/G101/ENG/GRM155R71E104KE14-01.pdf?src-supplier=Digi-Key; ComponentLink9URL: http://www.farnell.com/datasheets/2048008.pdf?src-supplier=Element14; ComponentLink9Description: http://www.farnell.com/datasheets/2048008.pdf?src-supplier=Element14; Dielectric: X7R; Voltage Rating: 25V
LED1 = LED BLUE CLEAR 2.8V 0603: Blue 470nm LED Indication - Discrete 2.8V 0603 (1608 Metric); Manufacturer 1: Lite-On Inc.; Manufacturer Part Number 1: LTST-C193TBKT-5A; Lens Color: Colorless; Millicandela Rating: 15mcd; Lens Style/Size: Rectangle with Flat Top, 1.15mm x 0.80mm; Current - Test: 5mA; Viewing Angle: 130°; Wavelength - Peak: 468nm; Supplier 1: Digi-Key; Supplier Part Number 1: 160-1827-1-ND; Packaging: Cut Tape (CT); Part Status: Active; Lens Transparency: Clear; Mounting Type: Surface Mount; Wavelength - Dominant: 470nm; Package / Case: 0603 (1608 Metric); Supplier Device Package: Chip LED; Size / Dimension: 1.60mm L x 0.80mm W; Height (Max): 0.45mm; ComponentLink1URL: http://optoelectronics.liteon.com/upload/download/DS22-2004-060/P_100_LTST-C193TBKT-5A.pdf; ComponentLink1Description: http://optoelectronics.liteon.com/upload/download/DS22-2004-060/P_100_LTST-C193TBKT-5A.pdf
R18 = RES ARRAY 10K OHM 5% 8RES EXB-2HV103JV: RES ARRAY SMD 10K 5% 62.5mW 1506; Manufacturer: Panasonic Electronic Components; Vendor: Panasonic; C: Copyright (C) 2015 Accelerated Designs. All rights reserved; Circuit Type: Isolated; Temperature Coefficient: ±200ppm/°C; Value: Value; Copyright: Copyright (C) 2015 Accelerated Designs. All rights reserved; Manufacturer_Part_Number: EXB-2HV103JV; Supplier 1: Digi-Key; Manufacturer Part Number: EXB-2HV103JV; RoHS: RoHS Compliant; Category: Resistors; Stock 1: 152779; Pricing 1: 1=0.43, 10=0.373, 25=0.2712, 50=0.1964, 100=0.1456, 250=0.11176, 500=0.08806, 1000=0.06096 (CAD); Packaging: Cut Tape (CT); Part Status: Active; Resistance (Ohms): 10k; Tolerance: ±5%; Power Per Element: 62.5mW; Operating Temperature: -55°C ~ 125°C; Applications: Automotive AEC-Q200; Mounting Type: Surface Mount; Package / Case: 1506, Convex, Long Side Terminals; Supplier Device Package: 1506; Size / Dimension: 0.150" L x 0.063" W (3.80mm x 1.60mm); Height - Seated (Max): 0.022" (0.55mm); ComponentLink1URL: https://industrial.panasonic.com/cdbs/www-data/pdf/AOC0000/AOC0000C14.pdf; ComponentLink1Description: https://industrial.panasonic.com/cdbs/www-data/pdf/AOC0000/AOC0000C14.pdf; Supplier Part Number 1: Y1103CT-ND
R19 = RES 10K OHM 1% 1/16W 0402: Surface Mount Thick Film Resistor, Rc Series, 10 Kohm, 62.5 Mw, - 1%, 50 V, 0402 [1005 Metric]; Manufacturer: Yageo; Manufacturer Part Number: RC0402FR-0710KL; Temperature Coefficient: 100ppm/°C; Voltage Rating: 50V; Power Rating: 62.5mW; Supplier 1: Digi-Key; Supplier Part Number 1: 311-10.0KLRCT-ND; Packaging: Tape and Reel; Composition: Thick Film; ComponentLink1URL: https://datasheet.ciiva.com/7660/38568-7660787.pdf?src-supplier=Element14; ComponentLink1Description: https://datasheet.ciiva.com/7660/38568-7660787.pdf?src-supplier=Element14; Tolerance: 1%; RoHS: Yes; Category: Chip SMD Resistors; Stock 1: 60761136; Pricing 1: 1=0.10000, 10=0.01600, 100=0.00640, 1000=0.00289, 2500=0.00251, 5000=0.00207 (USD); Case/Package: 0402; Number of Pins: 2; Case Code (Imperial): 0402; Case Code (Metric): 1005; Min Operating Temperature: -55°C; Max Operating Temperature: 155°C; Voltage Rating (DC): 50V; Termination: SMD/SMT; Military Standard: Not; Working Voltage: 50V; Number of Terminations: 2; Length: 1mm; Height: 0.32mm; Width: 0.5mm; Depth: 0.5mm; Lead Pitch: 0.2mm; REACH SVHC: No SVHC; Lead Free: Lead Free; ComponentLink2URL: https://datasheet.ciiva.com/7983/1018594-7983486.pdf?src-supplier=Element14; ComponentLink2Description: https://datasheet.ciiva.com/7983/1018594-7983486.pdf?src-supplier=Element14; ComponentLink3URL: https://datasheet.ciiva.com/7849/1784430-7849813.pdf?src-supplier=Element14; ComponentLink3Description: https://datasheet.ciiva.com/7849/1784430-7849813.pdf?src-supplier=Element14; ComponentLink4URL: https://datasheet.ciiva.com/7849/1686128-7849814.pdf?src-supplier=Element14; ComponentLink4Description: https://datasheet.ciiva.com/7849/1686128-7849814.pdf?src-supplier=Element14; ComponentLink5URL: https://datasheet.ciiva.com/7849/1784430-7849815.pdf?src-supplier=Element14; ComponentLink5Description: https://datasheet.ciiva.com/7849/1784430-7849815.pdf?src-supplier=Element14; ComponentLink6URL: https://datasheet.ciiva.com/22747/1018594-22747512.pdf?src-supplier=Element14; ComponentLink6Description: https://datasheet.ciiva.com/22747/1018594-22747512.pdf?src-supplier=Element14; ComponentLink7URL: https://datasheet.ciiva.com/12667/pyu-rc0402-51-rohs-l-6-r-12667067.pdf?src-supplier=Mouser; ComponentLink7Description: https://datasheet.ciiva.com/12667/pyu-rc0402-51-rohs-l-6-r-12667067.pdf?src-supplier=Mouser
U5 = IC I/O EXPANDER I2C 8CH 20 QFN: I/O Expander 8 I²C 1.7MHz 20-QFN-EP (4x4) /; Manufacturer 1: Microchip; Manufacturer Part Number 1: MCP23008T-E/ML; Interface: I2C,Serial; Number of I/Os: 8; Power Dissipation: 700mW; Operating Supply Voltage: 5.5V; ComponentLink1URL: http://www.microchip.com/mymicrochip/filehandler.aspx?ddocname=en021920; ComponentLink1Description: http://www.microchip.com/mymicrochip/filehandler.aspx?ddocname=en021920; Supplier 1: Digi-Key; Stock 1: 3994; Pricing 1: 1=1.10000, 25=0.92000, 100=0.84000 (USD); RoHS: Yes; Case/Package: QFN; Min Operating Temperature: -40°C; Max Operating Temperature: 125°C; Packaging: Tape and Reel; Package Quantity: 3300; Frequency: 1.7MHz; Max Frequency: 1.7MHz; Lead Free: Lead Free; ComponentLink2URL: https://datasheet.ciiva.com/16617/21919e-16617627.pdf?src-supplier=Avnet+Europe; ComponentLink2Description: https://datasheet.ciiva.com/16617/21919e-16617627.pdf?src-supplier=Avnet+Europe; ComponentLink3URL: https://datasheet.ciiva.com/12267/21919e-12267580.pdf?src-supplier=Mouser; ComponentLink3Description: https://datasheet.ciiva.com/12267/21919e-12267580.pdf?src-supplier=Mouser; ComponentLink4URL: https://datasheet.ciiva.com/8128/21919e-8128685.pdf?src-supplier=Avnet; ComponentLink4Description: https://datasheet.ciiva.com/8128/21919e-8128685.pdf?src-supplier=Avnet

## Sheet MIXR Power - Connectors.SchDoc: MIXR Power - Connectors
size B; Organization: Midnight Sun Solar Rayce Car Team; Address1: University of Waterloo; Address2: 200 University Ave W; Address3: Waterloo, ON, Canada; Address4: N2L 3E9; DocumentNumber: 3; SheetNumber: 3; SheetTotal: 8; Website: www.uwmidsun.com; ProjectName: ProjectName
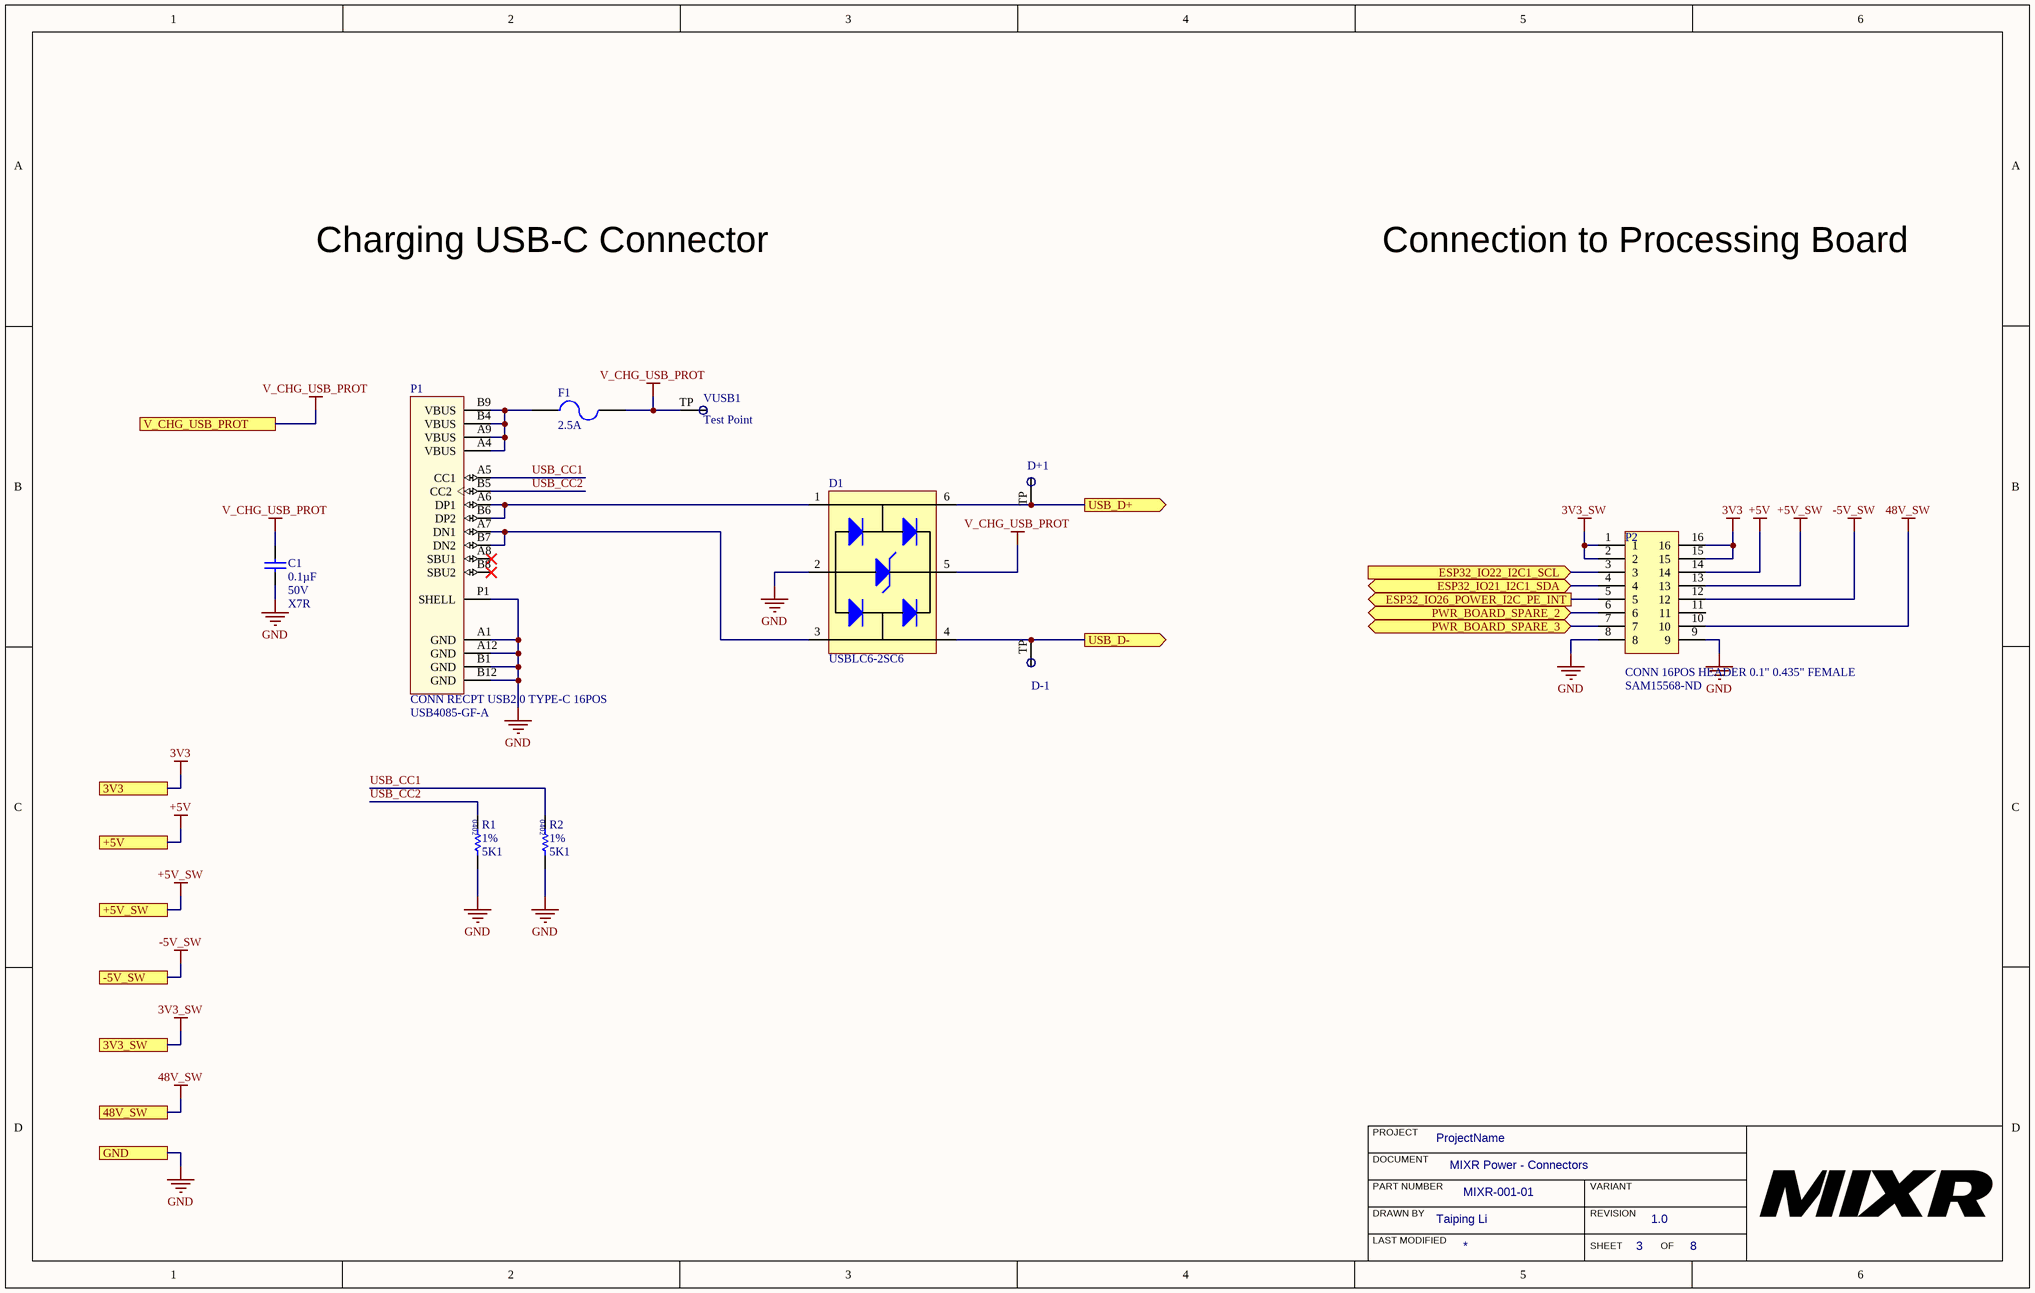
[diagram p6: MIXR Power - Connectors.SchDoc]

### Parts
C1  Capacitance: 0.1µF  Voltage: 50V  Temperature Coefficient: X7R  [CAP, 0603]  (hidden comment: CAP CER 0.1UF 50V 10% X7R 0603)
D1  Manufacturer Part Number 1: USBLC6-2SC6  [SOT23-6]  (hidden comment: DIODE TVS 5.25V 17V SOT23-6)
D+1  Test Point  [Test Point]  (value not drawn)  (no BOM)
D-1  Test Point  [Test Point]  (value not drawn)  (no BOM)
F1  Current Rating: 2.5A  [FUSE LITTLEFUSE 0466 1206]  (hidden comment: FUSE 2.5A 32VDC 1206)
P1  CONN RECPT USB2.0 TYPE-C 16POS  Manufacturer Part Number: USB4085-GF-A  [CONN RECPT USB2.0 TYPE C 16-POS]
P2  CONN 16POS HEADER 0.1" 0.435" FEMALE  Supplier Part Number 1: SAM15568-ND  [CONN, 16POS 0.100" 0.435" FEMALE]
R1  Tolerance: 1%  Resistance: 5K1  [RES 0402]  (hidden comment: RES 5.1K OHM 1% 1/16W 0402)
R2  Tolerance: 1%  Resistance: 5K1  [RES 0402]  (hidden comment: RES 5.1K OHM 1% 1/16W 0402)
VUSB1  Test Point  [Test Point]  (no BOM)

### Ports
3V3, 3V3_SW, 48V_SW, +5V, +5V_SW, -5V_SW, ESP32_IO21_I2C1_SDA (bidir), ESP32_IO22_I2C1_SCL (in), ESP32_IO26_POWER_I2C_PE_INT (out), GND, PWR_BOARD_SPARE_2 (bidir), PWR_BOARD_SPARE_3 (bidir), USB_D+ (out), USB_D- (out), V_CHG_USB_PROT

### Nets
3V3: P2.15 P2.16 ; port 3V3
3V3_SW: P2.1 P2.2 ; port 3V3_SW
48V_SW: P2.10 ; port 48V_SW
+5V: P2.14 ; port +5V
+5V_SW: P2.13 ; port +5V_SW
-5V_SW: P2.12 ; port -5V_SW
GND: C1.2 D1.2(Cathode2) P1.A1(GND) P1.A12(GND) P1.B1(GND) P1.B12(GND) P1.P1(SHELL) P2.8 P2.9 R1.2 R2.2 ; port GND
V_CHG_USB_PROT: C1.1 D1.5(Cathode4) F1.2 VUSB1.TP ; port V_CHG_USB_PROT
ESP32_IO21_I2C1_SDA: P2.4 ; port ESP32_IO21_I2C1_SDA
ESP32_IO22_I2C1_SCL: P2.3 ; port ESP32_IO22_I2C1_SCL
ESP32_IO26_POWER_I2C_PE_INT: P2.5 ; port ESP32_IO26_POWER_I2C_PE_INT
PWR_BOARD_SPARE_2: P2.6 ; port PWR_BOARD_SPARE_2
PWR_BOARD_SPARE_3: P2.7 ; port PWR_BOARD_SPARE_3
USB_CC1: P1.A5(CC1) R2.1  [project net USB_CC1_3]
USB_CC2: P1.B5(CC2) R1.1  [project net USB_CC2_3]
USB_D+: D1.6(Cathode3) D+1.TP ; port USB_D+
USB_D-: D1.4(Cathode2) D-1.TP ; port USB_D-
NetD1_1: D1.1(Cathode3) P1.A6(DP1) P1.B6(DP2)
NetD1_3: D1.3(Cathode1) P1.A7(DN1) P1.B7(DN2)
NetF1_1: F1.1 P1.A4(VBUS) P1.A9(VBUS) P1.B4(VBUS) P1.B9(VBUS)

Not connected (* = marked no-connect by the designer): P1 A8(SBU1)* B8(SBU2)*; P2 11

### Notes on the sheet
- Charging USB-C Connector
- Connection to Processing Board
- PROJECT
- DOCUMENT
- DRAWN BY
- LAST MODIFIED
- PART NUMBER
- REVISION
- SHEET
- VARIANT
- OF

### Library data of the parts
C1 = CAP CER 0.1UF 50V 10% X7R 0603: 0.10µF ±10% 50V Ceramic Capacitor X7R 0603 (1608 Metric); Manufacturer 1: AVX Corporation; Manufacturer Part Number 1: 06035C104KAT2A; Supplier 1: Digi-Key; Supplier Part Number 1: 478-5052-1-ND; Packaging: Cut Tape (CT); Part Status: Active; Operating Temperature: -55°C ~ 125°C; Ratings: -; Mounting Type: Surface Mount, MLCC; Package / Case: 0603 (1608 Metric); Size / Dimension: 0.063" L x 0.032" W (1.60mm x 0.81mm); Height - Seated (Max): -; Thickness (Max): 0.035" (0.90mm); Lead Spacing: -; Lead Style: -; ComponentLink1URL: http://datasheets.avx.com/X7RDielectric.pdf; ComponentLink1Description: http://datasheets.avx.com/X7RDielectric.pdf; Tolerance: ±10%
D1 = DIODE TVS 5.25V 17V SOT23-6: 17V Clamp 5A (8/20µs) Ipp Tvs Diode Surface Mount SOT-23-6; Manufacturer 1: STMicroelectronics; Data Rate: 480Mbps; Direction: Unidirectional; Capacitance: 3.5pF; Operating Supply Voltage: 1.1V; Number of Elements: 1; Number of Channels: 2; Reverse Breakdown Voltage: 6V; Working Voltage: 5V; Power Line Protection: Yes; Test Current: 1mA; Max Reverse Leakage Current: 150nA; Element Configuration: Dual; Supplier 1: Digi-Key; Stock 1: 7579; Pricing 1: 1=0.47000, 10=0.39900, 100=0.29820, 500=0.23430, 1000=0.18105 (USD); RoHS: Yes; Mount: Surface Mount; Case/Package: SOT-23; Number of Pins: 6; Contact Plating: Tin; Min Operating Temperature: -40°C; Max Operating Temperature: 125°C; Packaging: Tape and Reel; Package Quantity: 3000; Polarity: Unidirectional; Breakdown Voltage: 6V; Clamping Voltage: 17V; Termination: SMD/SMT; Number of Bidirectional Channels: 2; Reverse Standoff Voltage: 5.25V; Min Breakdown Voltage: 6V; ESD Protection: Yes; Max Breakdown Voltage: 6V; Leakage Current: 150nA; Peak Pulse Current: 5A; Length: 3.05mm; Height: 1.3mm; Width: 1.75mm; Depth: 1.75mm; Radiation Hardening: No; REACH SVHC: No SVHC; Lead Free: Lead Free; ComponentLink1URL: https://datasheet.ciiva.com/1268/1690354-1268384.pdf?src-supplier=Element14; ComponentLink1Description: https://datasheet.ciiva.com/1268/1690354-1268384.pdf?src-supplier=Element14; ComponentLink2URL: https://datasheet.ciiva.com/4508/cd00050750-113117-4508433.pdf?src-supplier=Mouser; ComponentLink2Description: https://datasheet.ciiva.com/4508/cd00050750-113117-4508433.pdf?src-supplier=Mouser; ComponentLink3URL: https://datasheet.ciiva.com/15143/getdatasheetpartid-148465-15143789.pdf?src-supplier=Verical; ComponentLink3Description: https://datasheet.ciiva.com/15143/getdatasheetpartid-148465-15143789.pdf?src-supplier=Verical; ComponentLink4URL: https://datasheet.ciiva.com/26787/usblc6-2sc6-26787908.pdf?src-supplier=IIIC; ComponentLink4Description: https://datasheet.ciiva.com/26787/usblc6-2sc6-26787908.pdf?src-supplier=IIIC; ComponentLink5URL: https://datasheet.ciiva.com/16200/cd00050750-16200026.pdf?src-supplier=Future+Electronics; ComponentLink5Description: https://datasheet.ciiva.com/16200/cd00050750-16200026.pdf?src-supplier=Future+Electronics; ComponentLink6URL: https://datasheet.ciiva.com/41444/001184109-da-01-en-ic-esd-protecti-usblc6-2sc6-sot-23-6-stm-41444156.pdf?src-supplier=Conrad; ComponentLink6Description: https://datasheet.ciiva.com/41444/001184109-da-01-en-ic-esd-protecti-usblc6-2sc6-sot-23-6-stm-41444156.pdf?src-supplier=Conrad; Supplier Part Number 1: 497-5235-1-ND
F1 = FUSE 2.5A 32VDC 1206: 2.5A 32V AC 32V DC Fuse Board Mount (Cartridge Style Excluded) Surface Mount 1206 (3216 Metric); Manufacturer 1: Littelfuse; Manufacturer Part Number 1: 046602.5NRHF; DC Cold Resistance: 24mR; Power Dissipation: 192.5mW; Approvals: UL; Supplier 1: Digi-Key; Stock 1: 4995; Pricing 1: 1=0.84000, 5=0.81200, 10=0.78700, 50=0.66180, 100=0.54930, 250=0.49940, 500=0.42450, 1000=0.37455 (USD); RoHS: Yes; Mount: Surface Mount; Case/Package: 1206; Case Code (Metric): 3216; Case Code (Imperial): 1206; Housing Material: Ceramic; Min Operating Temperature: -55°C; Max Operating Temperature: 90°C; Package Quantity: 5000; Voltage Rating (AC): 32V; Voltage Rating (DC): 32V; Packaging: Tape and Reel; Working Voltage: 32V; Fuse Type: Board Mount (Cartridge Style Excluded); Length: 3.18mm; Height: 0.023inch; Width: 0.06inch; Depth: 1.52mm; Lead Free: Lead Free; ComponentLink1URL: https://datasheet.ciiva.com/303/littelfuse-fuse-466-303217.pdf?src-supplier=Digi-Key; ComponentLink1Description: https://datasheet.ciiva.com/303/littelfuse-fuse-466-303217.pdf?src-supplier=Digi-Key; ComponentLink2URL: https://datasheet.ciiva.com/18652/littelfuse-fuse-466-datasheet-pdf-18652469.pdf?src-supplier=Digi-Key; ComponentLink2Description: https://datasheet.ciiva.com/18652/littelfuse-fuse-466-datasheet-pdf-18652469.pdf?src-supplier=Digi-Key; ComponentLink3URL: https://datasheet.ciiva.com/16327/littelfuse-fuse-466-16327471.pdf?src-supplier=Future+Electronics; ComponentLink3Description: https://datasheet.ciiva.com/16327/littelfuse-fuse-466-16327471.pdf?src-supplier=Future+Electronics; Supplier Part Number 1: F6143CT-ND
P1 = CONN RECPT USB2.0 TYPE-C 16POS: USB - C USB 2.0 Receptacle Connector 16 Position Through Hole, Right Angle; Manufacturer: Global Connector Technology; Supplier 1: Digi-Key; Supplier Part Number 1: 2073-USB4085-GF-ACT-ND; Stock 1: 286; Pricing 1: 1 = 1.440000, 10 = 1.307000, 25 = 1.227200, 50 = 1.174000, 100 = 1.120600, 250 = 1.013840 (USD); RoHS: No
P2 = CONN 16POS HEADER 0.1" 0.435" FEMALE: Conn Elevated Socket SKT 16 POS 2.54mm Solder ST Thru-Hole Tube; Manufacturer: Samtec; Manufacturer Part Number: ESQ-108-12-T-D; Max Current Rating: 6.9A; Contact Resistance: 10mR; Max Voltage Rating (AC): 550V; Gender: Receptacle; Number of Contacts: 16; Supplier 1: Digi-Key; RoHS: Yes; Stock 1: 40; Pricing 1: 1=1.84000, 10=1.66800, 100=1.43010, 500=1.19176, 1000=1.02150, 5000=0.90573, 10000=0.88530 (USD); Contact Plating: Tin; Contact Material: Bronze; Housing Material: Polyester; Number of Rows: 2; Packaging: Rail/Tube; Termination: Solder; Length: 20.83mm; Pitch: 2.54mm; ComponentLink1URL: http://components.arrow.com/part/dataview/2753158S6123219N1004?src-supplier=Arrow; ComponentLink1Description: http://components.arrow.com/part/dataview/2753158S6123219N1004?src-supplier=Arrow; ComponentLink2URL: http://www.farnell.com/datasheets/1992053.pdf?src-supplier=Farnell; ComponentLink2Description: http://www.farnell.com/datasheets/1992053.pdf?src-supplier=Farnell; Category: Headers and Wire Housings; Housing Color: Black; Min Operating Temperature: -55°C; Max Operating Temperature: 105°C; Orientation: Vertical; Depth: 4.95mm; Radiation Hardening: No; REACH SVHC: No SVHC; ComponentLink3URL: http://components.arrow.com/part/dataview/0323_01326666?src-supplier=Arrow+Europe; ComponentLink3Description: http://components.arrow.com/part/dataview/0323_01326666?src-supplier=Arrow+Europe; ComponentLink4URL: https://www.verical.com/server-webapp/html/getDatasheet?partID=176003&src-supplier=Verical; ComponentLink4Description: https://www.verical.com/server-webapp/html/getDatasheet?partID=176003&src-supplier=Verical; ComponentLink5URL: http://www.farnell.com/datasheets/1992053.pdf?src-supplier=Newark; ComponentLink5Description: http://www.farnell.com/datasheets/1992053.pdf?src-supplier=Newark; ComponentLink6URL: http://cloud.samtec.com/catalog_english/ESW_TH.PDF?src-supplier=Avnet; ComponentLink6Description: http://cloud.samtec.com/catalog_english/ESW_TH.PDF?src-supplier=Avnet; ComponentLink7URL: http://suddendocs.samtec.com/prints/esq-1xx-xx-x-x-xxx-xx-x-xx-mkt.pdf?src-supplier=Digi-Key; ComponentLink7Description: http://suddendocs.samtec.com/prints/esq-1xx-xx-x-x-xxx-xx-x-xx-mkt.pdf?src-supplier=Digi-Key
R1 R2 = RES 5.1K OHM 1% 1/16W 0402: 5.1 kOhms ±1% 0.063W, 1/16W Chip Resistor 0402 (1005 Metric) Automotive AEC-Q200 Thick Film; Manufacturer: Stackpole Electronics; Manufacturer Part Number: RMCF0402FT5K10; Power Rating: 62.5mW; Max Power Dissipation: 63mW; Temperature Coefficient: 100ppm/°C; Supplier 1: Digi-Key; RoHS: Yes; Category: Chip SMD Resistors; Stock 1: 76800; Pricing 1: 1=0.10000, 10=0.01400, 100=0.00580, 1000=0.00262, 2500=0.00228, 5000=0.00188 (USD); Mount: Surface Mount; Case/Package: 0402; Case Code (Metric): 1005; Case Code (Imperial): 0402; Contact Plating: Tin,Matte; Min Operating Temperature: -55°C; Max Operating Temperature: 155°C; Packaging: Tape and Reel; Composition: Thick Film; Number of Terminations: 2; Features: Automotive AEC-Q200; Length: 0.039inch; Height: 0.016inch; Width: 0.02inch; Radiation Hardening: No; ComponentLink1URL: https://www.seielect.com/catalog/SEI-RMCF_RMCP.pdf?src-supplier=Avnet; ComponentLink1Description: https://www.seielect.com/catalog/SEI-RMCF_RMCP.pdf?src-supplier=Avnet; ComponentLink2URL: https://www.seielect.com/catalog/SEI-Packaging.pdf?src-supplier=Digi-Key; ComponentLink2Description: https://www.seielect.com/catalog/SEI-Packaging.pdf?src-supplier=Digi-Key; ComponentLink3URL: http://components.arrow.com/part/dataview/51396875S385758N1174?src-supplier=Arrow; ComponentLink3Description: http://components.arrow.com/part/dataview/51396875S385758N1174?src-supplier=Arrow; ComponentLink4URL: https://www.seielect.com/catalog/SEI-RMCF_RMCP.pdf?src-supplier=Avnet+Asia; ComponentLink4Description: https://www.seielect.com/catalog/SEI-RMCF_RMCP.pdf?src-supplier=Avnet+Asia; Supplier Part Number 1: RMCF0402FT5K10CT-ND

## Sheet MIXR Power - Block Diagram.SchDoc: MIXR Power - Block Diagram
size B; Organization: Midnight Sun Solar Rayce Car Team; Address1: University of Waterloo; Address2: 200 University Ave W; Address3: Waterloo, ON, Canada; Address4: N2L 3E9; DocumentNumber: 2; SheetNumber: 2; SheetTotal: 8; Website: www.uwmidsun.com; ProjectName: ProjectName

### Notes on the sheet
- PROJECT
- DOCUMENT
- DRAWN BY
- LAST MODIFIED
- PART NUMBER
- REVISION
- SHEET
- VARIANT
- OF
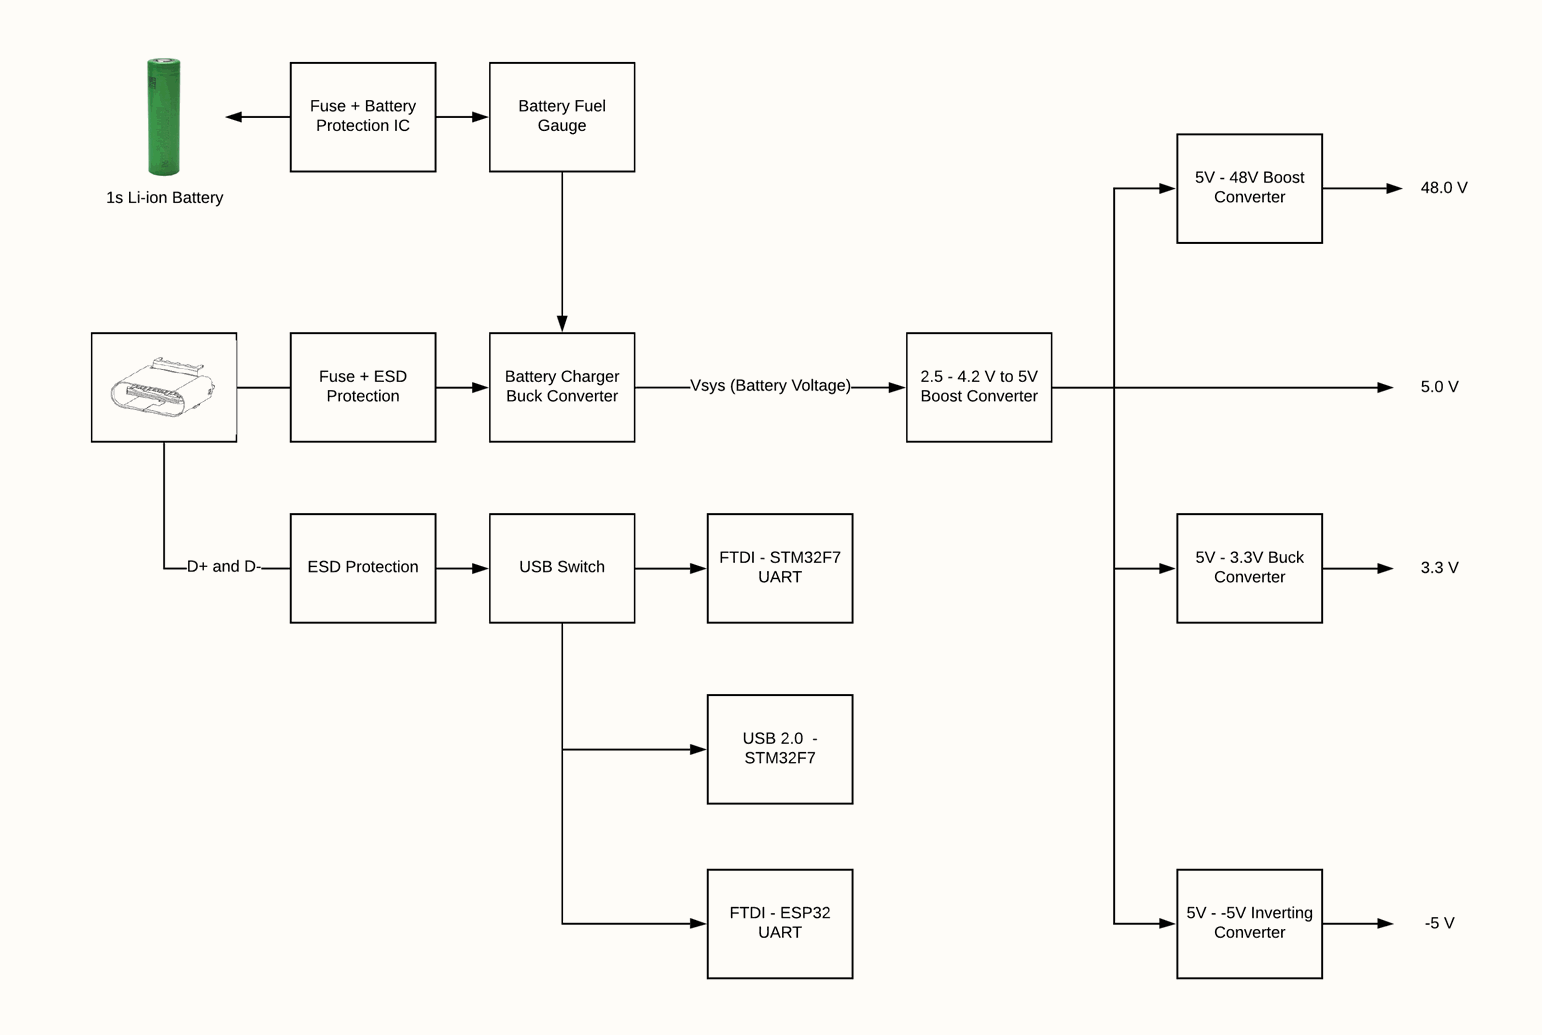
[diagram p7: MIXR Power - Block Diagram.SchDoc]

## Nets that join several sheets
3V3: MIXR Power - 5V & 3V3 Regulators (9 pins), MIXR Power - Port Expander (7 pins), MIXR Power - Connectors (P2.15 P2.16)
3V3_SW: MIXR Power - 5V & 3V3 Regulators (Q4.3 R35.1), MIXR Power - Connectors (P2.1 P2.2)
48V_SW: MIXR Power - 48V Phantom Power Supply (U4.3), MIXR Power - Connectors (P2.10)
+5V: MIXR Power - 5V & 3V3 Regulators (18 pins), MIXR Power - Connectors (P2.14)
+5V_SW: MIXR Power - 5V & 3V3 Regulators (Q3.3 R34.1), MIXR Power - Connectors (P2.13)
-5V_SW: MIXR Power - 5V & 3V3 Regulators (6 pins), MIXR Power - Connectors (P2.12)
GND: MIXR Power - 5V & 3V3 Regulators (37 pins), MIXR Power - 48V Phantom Power Supply (20 pins), MIXR Power - Battery Charging (12 pins), MIXR Power - Battery Management (8 pins), MIXR Power - Port Expander (12 pins), MIXR Power - Connectors (11 pins)
V_CHG_USB_PROT: MIXR Power - Battery Charging (C2.1 U1.1 U1.24), MIXR Power - Connectors (C1.1 D1.5 F1.2 VUSB1.TP)
V_SYS: MIXR Power - 5V & 3V3 Regulators (R21.1), MIXR Power - 48V Phantom Power Supply (F2.1), MIXR Power - Battery Charging (5 pins)
VBAT_PROT: MIXR Power - Battery Charging (C6.1 U1.13 U1.14), MIXR Power - Battery Management (R20.2 U6.10)
ESP32_IO21_I2C1_SDA: MIXR Power - Battery Management (U6.13), MIXR Power - Port Expander (U5.20), MIXR Power - Connectors (P2.4)
ESP32_IO22_I2C1_SCL: MIXR Power - Battery Management (U6.14), MIXR Power - Port Expander (U5.19), MIXR Power - Connectors (P2.3)
ESP32_IO26_POWER_I2C_PE_INT: MIXR Power - Port Expander (R19.2 U5.7), MIXR Power - Connectors (P2.5)
ESP32_PWR_PE_GP0_nSW_EN: MIXR Power - 5V & 3V3 Regulators (R26.1 R30.2 R32.1 R39.1), MIXR Power - Port Expander (R18.16 U5.9)
ESP32_PWR_PE_GP1_PHANTOM_PWR_EN: MIXR Power - 48V Phantom Power Supply (R17.1), MIXR Power - Port Expander (U5.10)
ESP32_PWR_PE_GP2_49V2_REG_EN: MIXR Power - 48V Phantom Power Supply (R13.1), MIXR Power - Port Expander (R18.15 U5.11)
ESP32_PWR_PE_GP3_nBAT_CHG_EN: MIXR Power - Battery Charging (U1.9), MIXR Power - Port Expander (R18.14 U5.12)
ESP32_PWR_PE_GP4_BAT_GAUGE_ALRT: MIXR Power - Battery Management (U6.12), MIXR Power - Port Expander (R18.13 U5.13)
ESP32_PWR_PE_GP5_BAT_CHG_nPG: MIXR Power - Battery Charging (U1.7), MIXR Power - Port Expander (R18.12 U5.14)
ESP32_PWR_PE_GP6_BAT_CHG_STATUS: MIXR Power - Battery Charging (U1.5), MIXR Power - Port Expander (R18.11 U5.15)
USB_D+: MIXR Power - Battery Charging (U1.3), MIXR Power - Connectors (D1.6 D+1.TP)
USB_D-: MIXR Power - Battery Charging (U1.4), MIXR Power - Connectors (D1.4 D-1.TP)